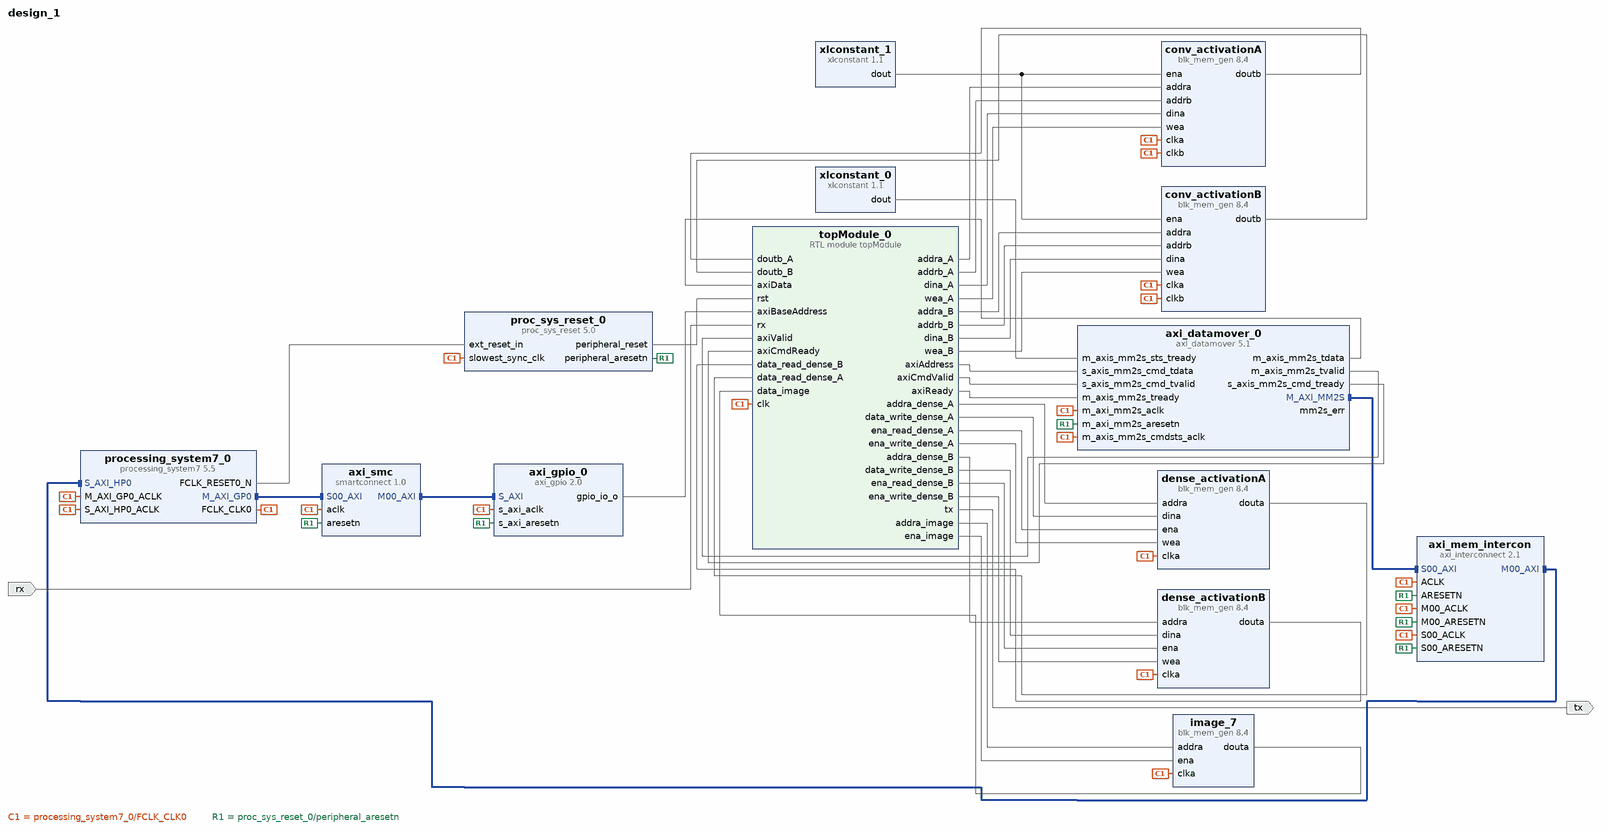
[diagram p0: block diagram of the top level]
# Vivado block design design_1, xc7z020clg400-1, Vivado 2025.2
create_bd_design design_1

create_bd_port -dir O tx
create_bd_port -dir I rx

create_bd_cell -type module -reference topModule topModule_0
create_bd_cell -type ip -vlnv xilinx.com:ip:blk_mem_gen:8.4 image_7
set_property -dict [list \
  CONFIG.Coe_File ../../../../../../../fpga_data/image.coe \
  CONFIG.Load_Init_File true \
  CONFIG.Memory_Type Single_Port_ROM \
  CONFIG.Write_Depth_A 2304 \
  CONFIG.Write_Width_A 8 \
  CONFIG.use_bram_block Stand_Alone \
] [get_bd_cells image_7]
create_bd_cell -type ip -vlnv xilinx.com:ip:processing_system7:5.5 processing_system7_0
set_property -dict {CONFIG.PCW_FPGA0_PERIPHERAL_FREQMHZ 100 CONFIG.PCW_USE_S_AXI_HP0 1} [get_bd_cells processing_system7_0]
# 34 more settings of processing_system7_0 are not shown: defaults, MIO pin electricals, DDR timing, and values the tool derives
create_bd_cell -type ip -vlnv xilinx.com:ip:proc_sys_reset:5.0 proc_sys_reset_0
create_bd_cell -type ip -vlnv xilinx.com:ip:axi_datamover:5.1 axi_datamover_0
set_property -dict [list \
  CONFIG.c_dummy 1 \
  CONFIG.c_enable_s2mm 0 \
  CONFIG.c_include_mm2s Full \
  CONFIG.c_m_axi_mm2s_data_width 1024 \
  CONFIG.c_m_axis_mm2s_tdata_width 1024 \
] [get_bd_cells axi_datamover_0]
create_bd_cell -type ip -vlnv xilinx.com:ip:axi_interconnect:2.1 axi_mem_intercon
set_property -dict {CONFIG.NUM_MI 1} [get_bd_cells axi_mem_intercon]
create_bd_cell -type ip -vlnv xilinx.com:ip:xlconstant:1.1 xlconstant_0
create_bd_cell -type ip -vlnv xilinx.com:ip:axi_gpio:2.0 axi_gpio_0
create_bd_cell -type ip -vlnv xilinx.com:ip:smartconnect:1.0 axi_smc
set_property -dict {CONFIG.NUM_SI 1} [get_bd_cells axi_smc]
create_bd_cell -type ip -vlnv xilinx.com:ip:blk_mem_gen:8.4 dense_activationA
set_property -dict [list \
  CONFIG.Use_RSTA_Pin false \
  CONFIG.Write_Depth_A 4096 \
  CONFIG.Write_Width_A 16 \
  CONFIG.use_bram_block Stand_Alone \
] [get_bd_cells dense_activationA]
create_bd_cell -type ip -vlnv xilinx.com:ip:blk_mem_gen:8.4 dense_activationB
set_property -dict [list \
  CONFIG.Use_RSTA_Pin false \
  CONFIG.Write_Depth_A 4096 \
  CONFIG.Write_Width_A 16 \
  CONFIG.use_bram_block Stand_Alone \
] [get_bd_cells dense_activationB]
create_bd_cell -type ip -vlnv xilinx.com:ip:blk_mem_gen:8.4 conv_activationA
set_property -dict [list \
  CONFIG.Enable_A Use_ENA_Pin \
  CONFIG.Enable_B Always_Enabled \
  CONFIG.Memory_Type Simple_Dual_Port_RAM \
  CONFIG.Operating_Mode_A WRITE_FIRST \
  CONFIG.Write_Depth_A 147456 \
  CONFIG.Write_Width_A 8 \
  CONFIG.use_bram_block Stand_Alone \
] [get_bd_cells conv_activationA]
create_bd_cell -type ip -vlnv xilinx.com:ip:blk_mem_gen:8.4 conv_activationB
set_property -dict [list \
  CONFIG.Enable_A Use_ENA_Pin \
  CONFIG.Enable_B Always_Enabled \
  CONFIG.Memory_Type Simple_Dual_Port_RAM \
  CONFIG.Operating_Mode_A WRITE_FIRST \
  CONFIG.Write_Depth_A 147456 \
  CONFIG.Write_Width_A 8 \
  CONFIG.use_bram_block Stand_Alone \
] [get_bd_cells conv_activationB]
create_bd_cell -type ip -vlnv xilinx.com:ip:xlconstant:1.1 xlconstant_1

# ---- connections ----

connect_bd_intf_net [get_bd_intf_pins axi_datamover_0/M_AXI_MM2S] [get_bd_intf_pins axi_mem_intercon/S00_AXI]
connect_bd_intf_net [get_bd_intf_pins axi_mem_intercon/M00_AXI] [get_bd_intf_pins processing_system7_0/S_AXI_HP0]
connect_bd_intf_net [get_bd_intf_pins axi_smc/M00_AXI] [get_bd_intf_pins axi_gpio_0/S_AXI]
connect_bd_intf_net [get_bd_intf_pins processing_system7_0/M_AXI_GP0] [get_bd_intf_pins axi_smc/S00_AXI]
connect_bd_net -net activationB_douta [get_bd_pins dense_activationB/douta] [get_bd_pins topModule_0/data_read_dense_B]
connect_bd_net [get_bd_pins axi_datamover_0/m_axis_mm2s_tdata] [get_bd_pins topModule_0/axiData]
connect_bd_net [get_bd_pins axi_datamover_0/m_axis_mm2s_tvalid] [get_bd_pins topModule_0/axiValid]
# net axi_datamover_0_mm2s_err has one end: axi_datamover_0/mm2s_err
connect_bd_net [get_bd_pins axi_datamover_0/s_axis_mm2s_cmd_tready] [get_bd_pins topModule_0/axiCmdReady]
connect_bd_net [get_bd_pins axi_gpio_0/gpio_io_o] [get_bd_pins topModule_0/axiBaseAddress]
connect_bd_net -net blk_mem_gen_0_douta [get_bd_pins dense_activationA/douta] [get_bd_pins topModule_0/data_read_dense_A]
connect_bd_net -net clk_wiz_0_clk_out [get_bd_pins processing_system7_0/FCLK_CLK0] \
  [get_bd_pins image_7/clka] [get_bd_pins processing_system7_0/M_AXI_GP0_ACLK] \
  [get_bd_pins proc_sys_reset_0/slowest_sync_clk] [get_bd_pins axi_mem_intercon/ACLK] \
  [get_bd_pins axi_datamover_0/m_axi_mm2s_aclk] [get_bd_pins axi_mem_intercon/S00_ACLK] \
  [get_bd_pins processing_system7_0/S_AXI_HP0_ACLK] [get_bd_pins axi_mem_intercon/M00_ACLK] \
  [get_bd_pins axi_datamover_0/m_axis_mm2s_cmdsts_aclk] [get_bd_pins axi_gpio_0/s_axi_aclk] [get_bd_pins axi_smc/aclk] \
  [get_bd_pins dense_activationA/clka] [get_bd_pins dense_activationB/clka] [get_bd_pins conv_activationA/clka] \
  [get_bd_pins conv_activationA/clkb] [get_bd_pins conv_activationB/clka] [get_bd_pins conv_activationB/clkb] \
  [get_bd_pins topModule_0/clk]
connect_bd_net [get_bd_pins conv_activationA/doutb] [get_bd_pins topModule_0/doutb_A]
connect_bd_net [get_bd_pins conv_activationB/doutb] [get_bd_pins topModule_0/doutb_B]
connect_bd_net [get_bd_pins image_7/douta] [get_bd_pins topModule_0/data_image]
connect_bd_net [get_bd_pins proc_sys_reset_0/peripheral_aresetn] \
  [get_bd_pins axi_datamover_0/m_axi_mm2s_aresetn] [get_bd_pins axi_mem_intercon/S00_ARESETN] \
  [get_bd_pins axi_mem_intercon/M00_ARESETN] [get_bd_pins axi_mem_intercon/ARESETN] [get_bd_pins axi_gpio_0/s_axi_aresetn] \
  [get_bd_pins axi_smc/aresetn]
connect_bd_net [get_bd_pins proc_sys_reset_0/peripheral_reset] [get_bd_pins topModule_0/rst]
connect_bd_net [get_bd_pins processing_system7_0/FCLK_RESET0_N] [get_bd_pins proc_sys_reset_0/ext_reset_in]
connect_bd_net -net rx_0_1 [get_bd_ports rx] [get_bd_pins topModule_0/rx]
connect_bd_net [get_bd_pins topModule_0/addra_A] [get_bd_pins conv_activationA/addra]
connect_bd_net [get_bd_pins topModule_0/addra_B] [get_bd_pins conv_activationB/addra]
connect_bd_net -net topModule_0_addra_activation [get_bd_pins topModule_0/addra_dense_A] [get_bd_pins dense_activationA/addra]
connect_bd_net -net topModule_0_addra_activation_B [get_bd_pins topModule_0/addra_dense_B] [get_bd_pins dense_activationB/addra]
connect_bd_net [get_bd_pins topModule_0/addra_image] [get_bd_pins image_7/addra]
connect_bd_net [get_bd_pins topModule_0/addrb_A] [get_bd_pins conv_activationA/addrb]
connect_bd_net [get_bd_pins topModule_0/addrb_B] [get_bd_pins conv_activationB/addrb]
connect_bd_net [get_bd_pins topModule_0/axiAddress] [get_bd_pins axi_datamover_0/s_axis_mm2s_cmd_tdata]
connect_bd_net [get_bd_pins topModule_0/axiCmdValid] [get_bd_pins axi_datamover_0/s_axis_mm2s_cmd_tvalid]
connect_bd_net [get_bd_pins topModule_0/axiReady] [get_bd_pins axi_datamover_0/m_axis_mm2s_tready]
connect_bd_net -net topModule_0_data_write_activation [get_bd_pins topModule_0/data_write_dense_A] [get_bd_pins dense_activationA/dina]
connect_bd_net -net topModule_0_data_write_activation_B [get_bd_pins topModule_0/data_write_dense_B] [get_bd_pins dense_activationB/dina]
connect_bd_net [get_bd_pins topModule_0/dina_A] [get_bd_pins conv_activationA/dina]
connect_bd_net [get_bd_pins topModule_0/dina_B] [get_bd_pins conv_activationB/dina]
connect_bd_net [get_bd_pins topModule_0/ena_image] [get_bd_pins image_7/ena]
connect_bd_net -net topModule_0_ena_read_activation [get_bd_pins topModule_0/ena_read_dense_A] [get_bd_pins dense_activationA/ena]
connect_bd_net -net topModule_0_ena_read_activation_B [get_bd_pins topModule_0/ena_read_dense_B] [get_bd_pins dense_activationB/ena]
connect_bd_net -net topModule_0_ena_write_activation [get_bd_pins topModule_0/ena_write_dense_A] [get_bd_pins dense_activationA/wea]
connect_bd_net -net topModule_0_ena_write_activation_B [get_bd_pins topModule_0/ena_write_dense_B] [get_bd_pins dense_activationB/wea]
connect_bd_net [get_bd_pins topModule_0/tx] [get_bd_ports tx]
connect_bd_net [get_bd_pins topModule_0/wea_A] [get_bd_pins conv_activationA/wea]
connect_bd_net [get_bd_pins topModule_0/wea_B] [get_bd_pins conv_activationB/wea]
connect_bd_net [get_bd_pins xlconstant_0/dout] [get_bd_pins axi_datamover_0/m_axis_mm2s_sts_tready]
connect_bd_net [get_bd_pins xlconstant_1/dout] [get_bd_pins conv_activationA/ena] [get_bd_pins conv_activationB/ena]

# ---- address map ----
assign_bd_address -offset 0x00000000 -range 512M -target_address_space [get_bd_addr_spaces axi_datamover_0/Data_MM2S] [get_bd_addr_segs processing_system7_0/S_AXI_HP0/HP0_DDR_LOWOCM]
assign_bd_address -offset 0x41200000 -range 64K -target_address_space [get_bd_addr_spaces processing_system7_0/Data] [get_bd_addr_segs axi_gpio_0/S_AXI/Reg]

validate_bd_design
save_bd_design
